# EAGLE design 328p_ver3_without_gnd_plane (EAGLE 7.1.0)
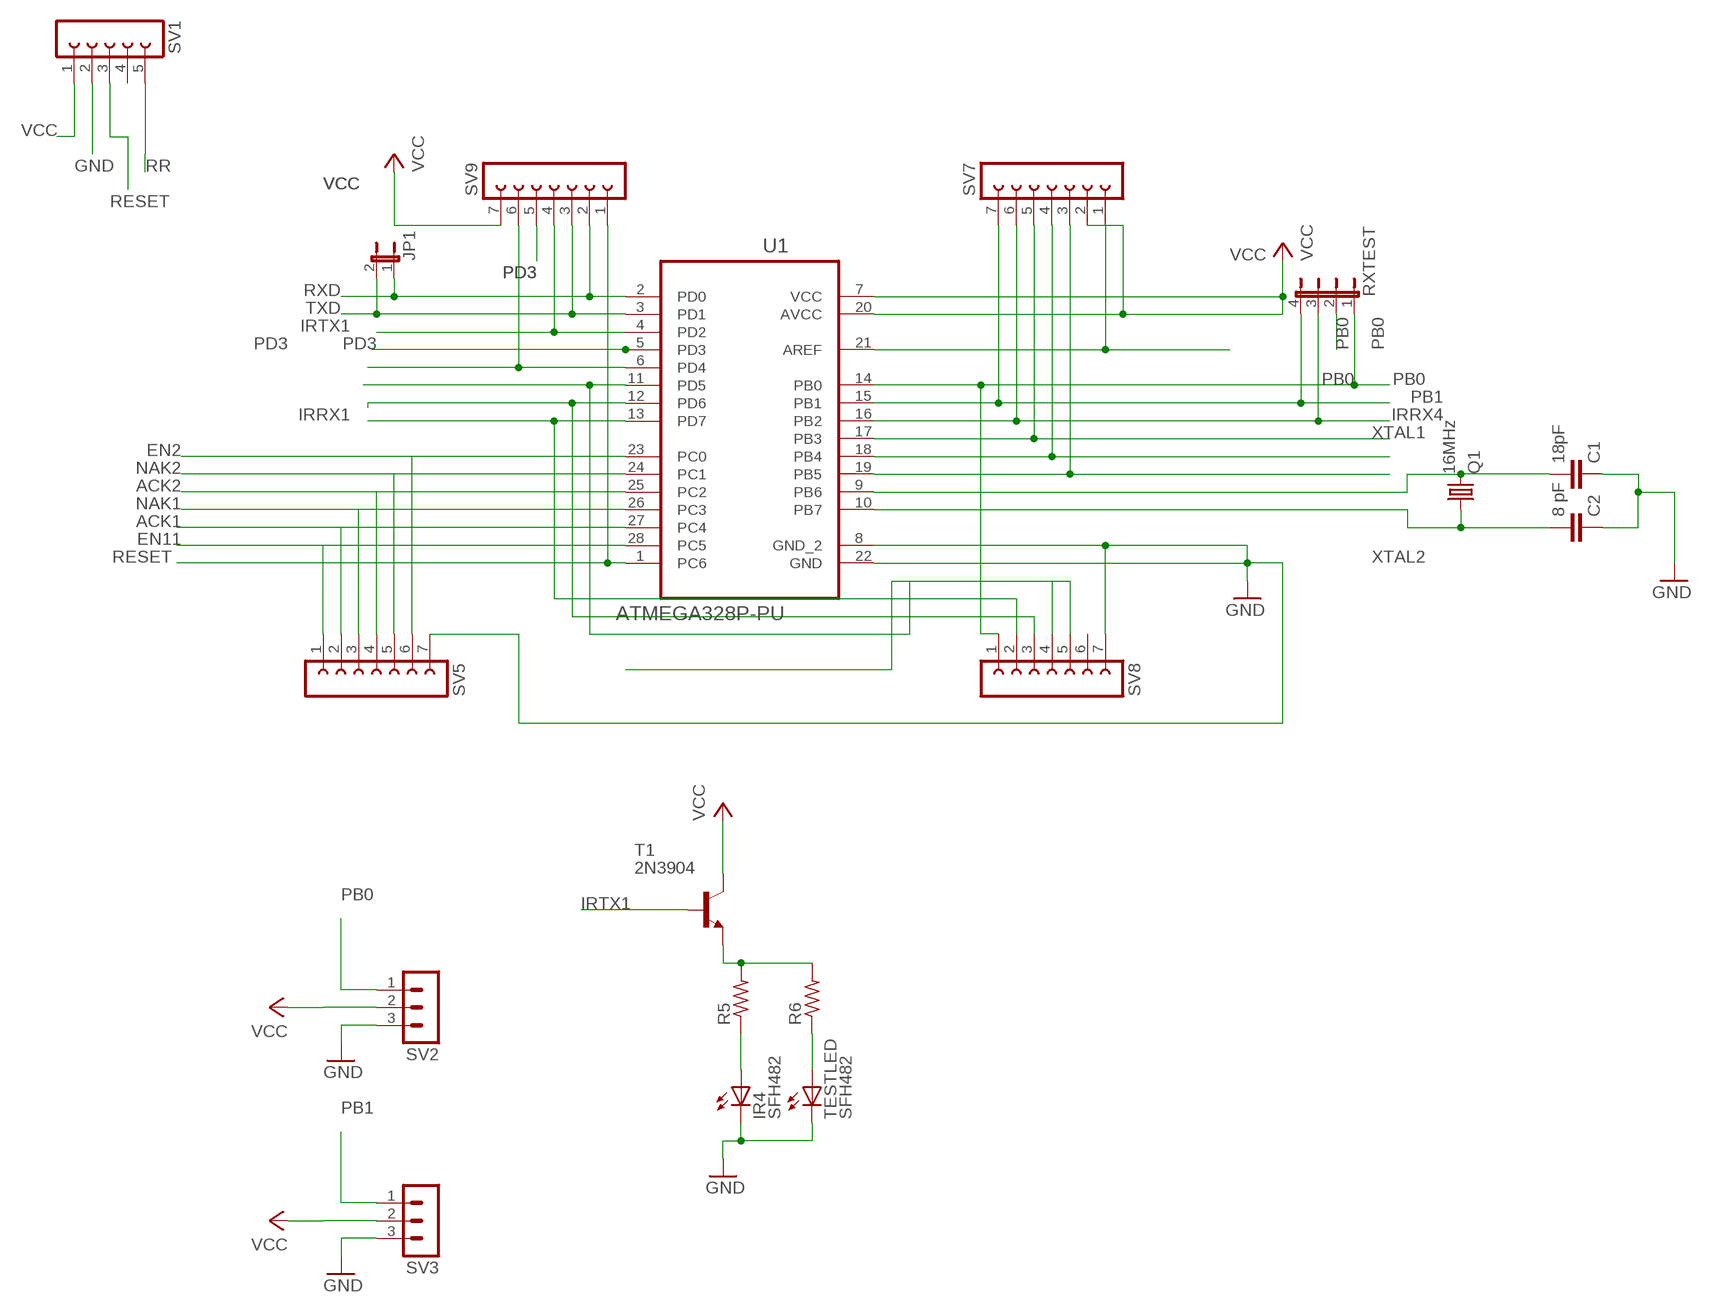
[diagram p0: schematic, sheet 1]

## Parts
C1  18pF  C2,5-3  [C2.5-3]
C2  8 pF  C2,5-3  [C2.5-3]
IR4  SFH482  [SFH482]
JP1  JP1E  [JP1]
Q1  16MHz  CRYSTALHC49S  [HC49/S]
R5  R-US_0204/7  [0204/7]
R6  R-US_0204/7  [0204/7]
RXTEST  JP4E  [JP4]
SV1  FE05-1  [FE05-1]
SV2  MA03-1  [MA03-1]
SV3  MA03-1  [MA03-1]
SV5  FE07-1  [FE07]
SV7  FE07-1  [FE07]
SV8  FE07-1  [FE07]
SV9  FE07-1  [FE07]
T1  2N3904  [TO92]
TESTLED  SFH482  [SFH482]
U1  ATMEGA328P-PU  [DIP254P762X457-28]

## Nets
ACK1: SV5.2 U1.27(PC4)
ACK2: SV5.4 U1.25(PC2)
EN1: SV8.5
EN2: SV5.6 U1.23(PC0)
EN11: SV5.1 U1.28(PC5)
GND: C1.1 C2.1 IR4.K(C) SV1.2 SV2.3 SV3.3 SV5.7 SV8.7 TESTLED.K(C) U1.8(GND_2) U1.22(GND)
IRRX1: RXTEST.2 SV8.2 U1.13(PD7)
IRRX4: RXTEST.3 SV7.6 U1.16(PB2)
IRTX1: SV9.4 T1.2(B) U1.4(PD2)
N$5: IR4.A R5.1
N$6: R5.2 R6.2 T1.3(E)
N$10: R6.1 TESTLED.A
N$15: SV7.5 U1.17(PB3)
N$16: SV7.4 U1.18(PB4)
N$17: SV7.3 U1.19(PB5)
N$18: SV7.1 U1.21(AREF)
N$20: SV9.6 U1.6(PD4)
N$21: SV2.2 SV3.2 T1.1(C) ; supply symbol labelled VCC
N$25: SV8.3 U1.12(PD6)
NAK1: SV5.3 U1.26(PC3)
NAK2: SV5.5 U1.24(PC1)
PB0: RXTEST.1 SV2.1 SV8.1 U1.14(PB0)
PB1: RXTEST.4 SV3.1 SV7.7 U1.15(PB1)
PD3: SV9.5 U1.5(PD3)
PD5: SV8.4 U1.11(PD5)
RESET: SV1.3 SV9.1 U1.1(PC6)
RR: SV1.5
RXD: JP1.1 SV9.2 U1.2(PD0)
TXD: JP1.2 SV9.3 U1.3(PD1)
VCC: SV1.1 SV7.2 SV9.7 U1.7(VCC) U1.20(AVCC)
XTAL1: C1.2 Q1.2 U1.9(PB6)
XTAL2: C2.2 Q1.1 U1.10(PB7)
Unconnected: SV1.4 SV8.6

## Library data of the parts
C1 C2 = capacitor-wima:C: CAPACITOR naming: grid - package width
IR4 TESTLED = led:SFH482: IR LED infrared emitting diode, Infineon
JP1 = jumper:JP1E: JUMPER
Q1 = crystal:CRYSTAL: CRYSTAL; OC_FARNELL: 1667008; OC_NEWARK: unknown
R5 R6 = resistor:R-US_: RESISTOR, American symbol
RXTEST = jumper:JP4E: JUMPER
SV1 = con-lsta:FE05-1: FEMALE HEADER; OC_FARNELL: unknown; OC_NEWARK: unknown
SV2 SV3 = con-lstb:MA03-1: PIN HEADER; OC_FARNELL: unknown; OC_NEWARK: unknown
SV5 SV7-SV9 = con-lsta:FE07-1: FEMALE HEADER; OC_FARNELL: unknown; OC_NEWARK: unknown
T1 = transistor:2N3904: NPN TRANSISTOR
U1 = Atmel_By_element14_Batch_1-00:ATMEGA328P-PU: 8-bit Microcontroller with In-System Programmable Flash; MPN: ATMEGA328P-PU; OC_FARNELL: 1715487; OC_NEWARK: 15R0268; PACKAGE: PDIP-28; SUPPLIER: Atmel

## Board
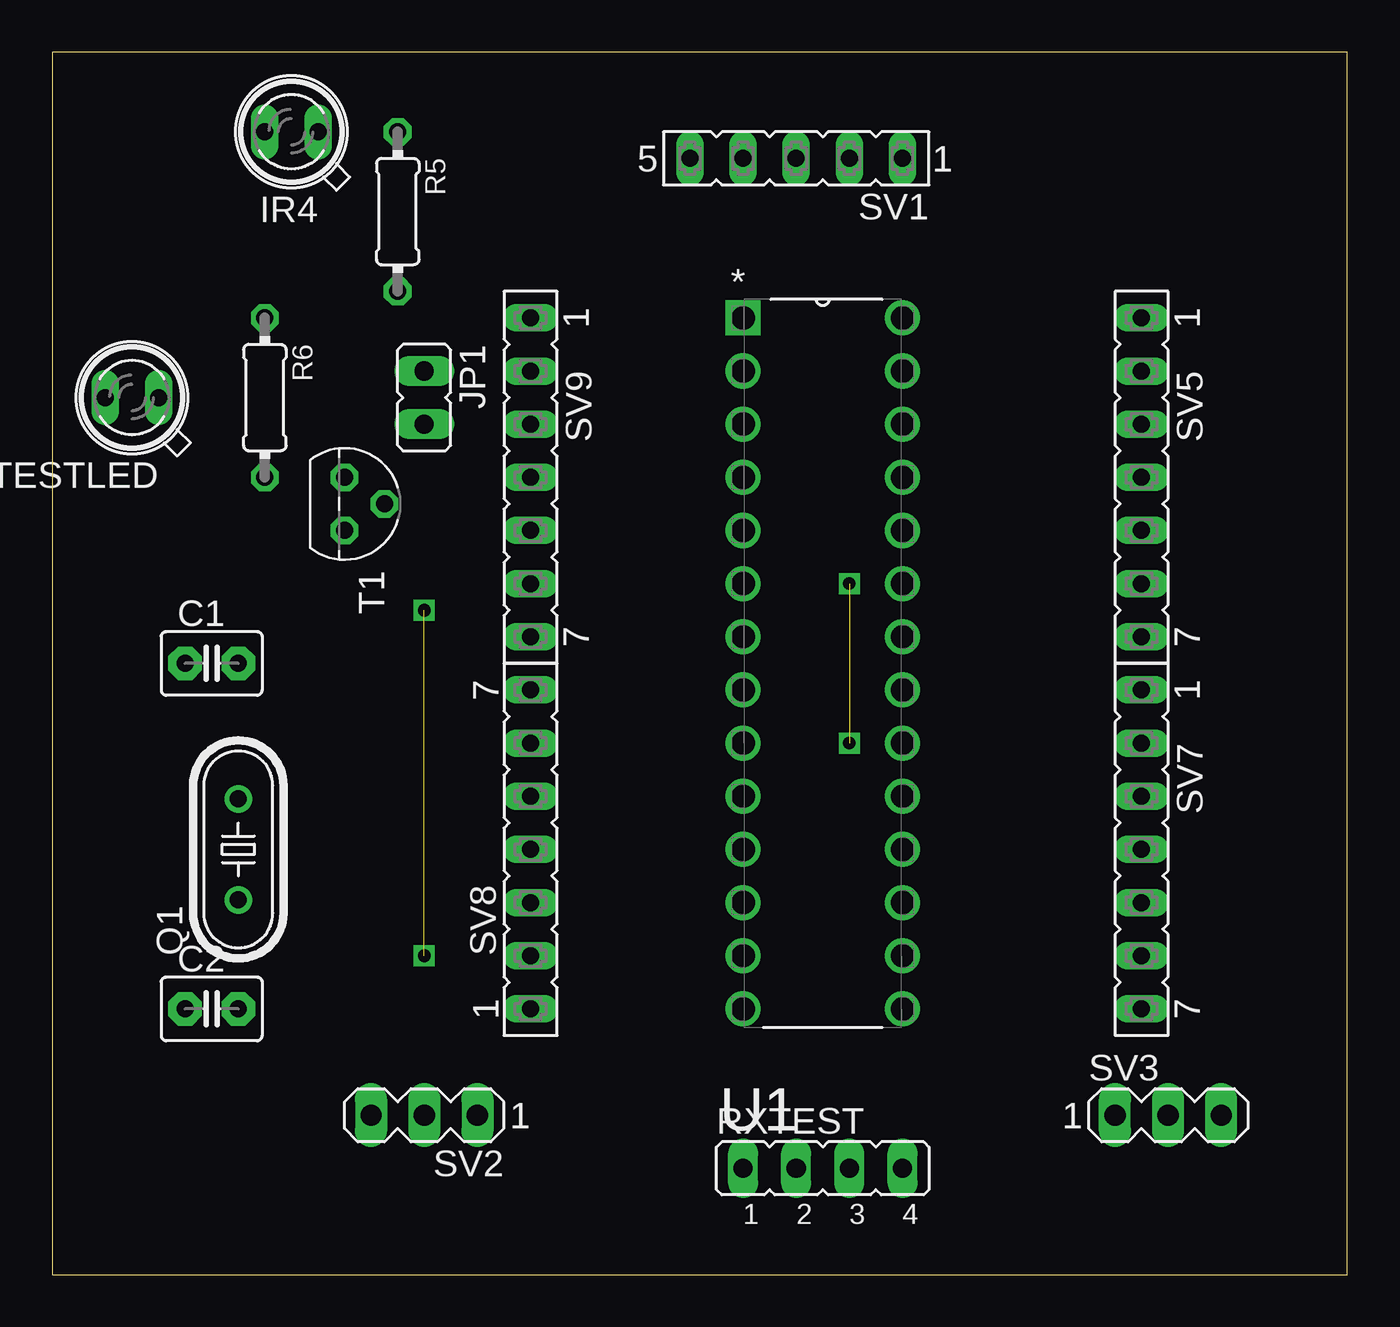
[diagram p1: board, top side]
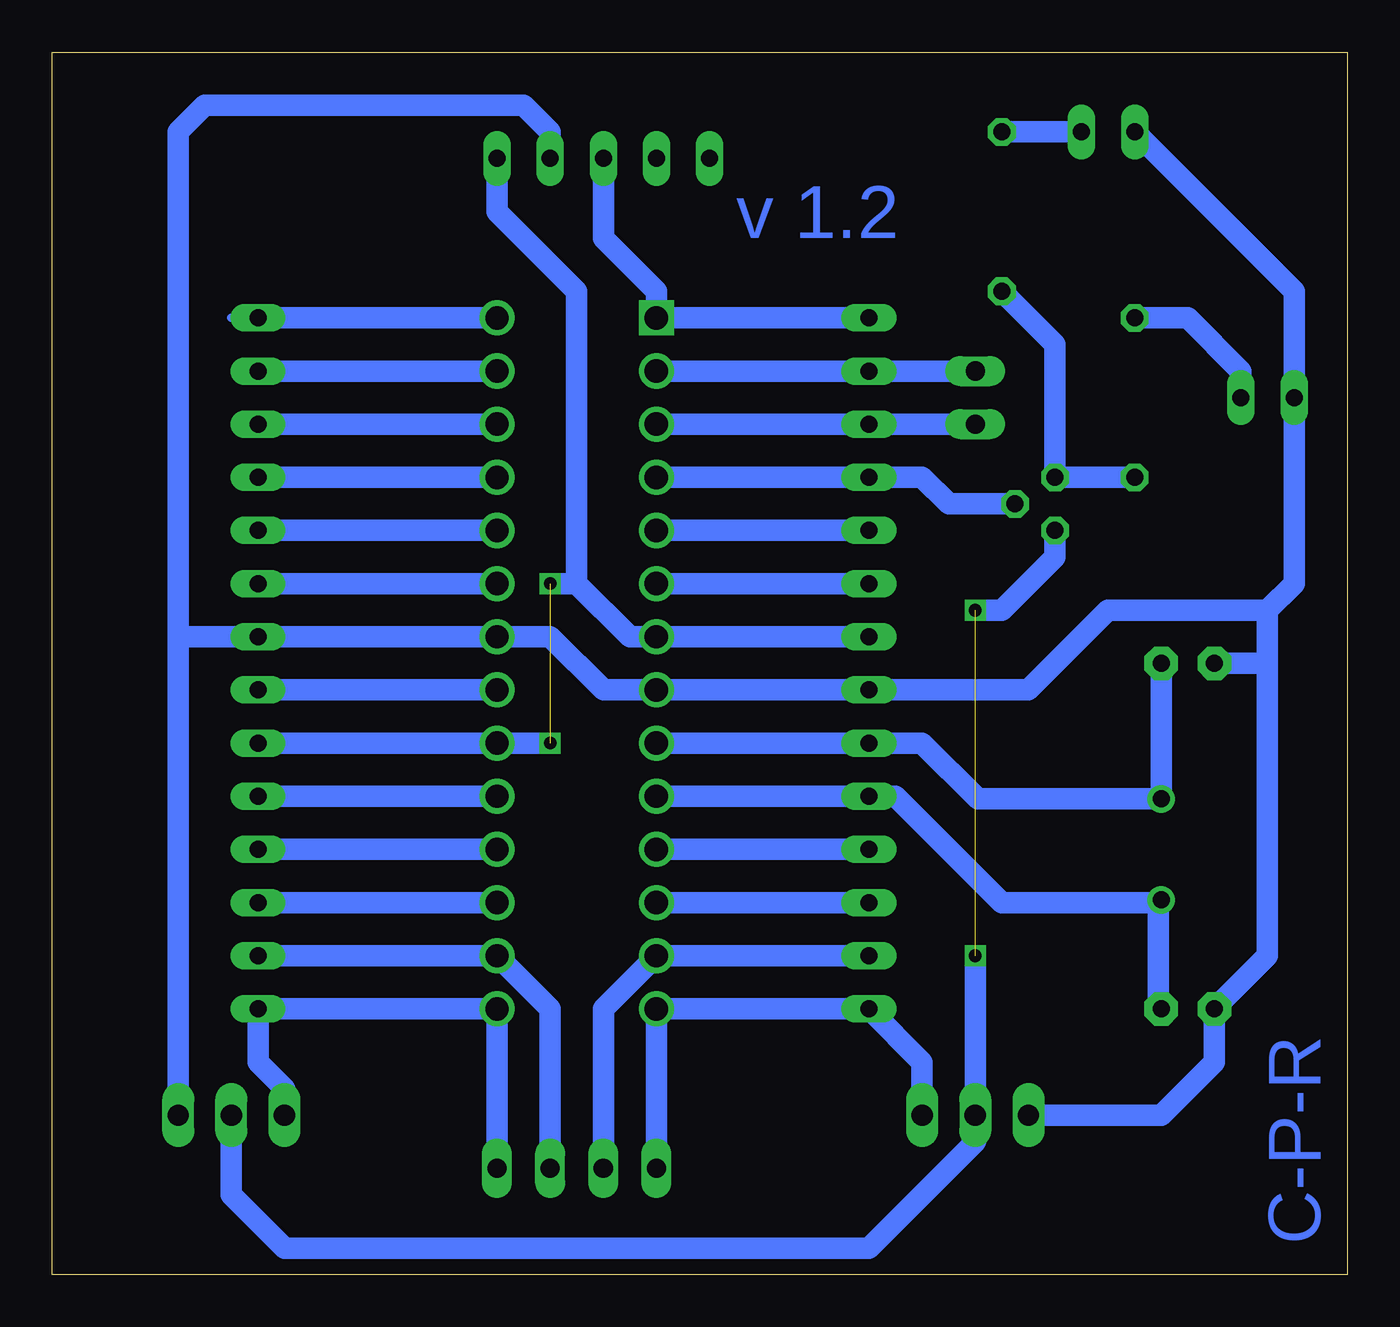
[diagram p2: board, bottom side, seen from below]

Size 61.9 x 58.41 mm. Coordinates in mm from the lower left corner, seen from the top.
Outline: 0,0 61.9,0 61.9,58.41 0,58.41 0,0
Copper layers (1*16): Top 0.035mm / dielectric 1.5mm / Bottom 0.035mm
Design rules "default": minimum track width 10mil, minimum drill 24mil, track to track 8mil, track to pad 8mil, pad to pad 8mil, via to via 8mil, smd to smd 8mil, copper to edge 40mil, drill to drill 8mil, minimum pad ring 10mil, minimum via ring 8mil, stop-mask expansion 4mil, vias tented up to drill 0mil, thermal gap 10mil

### Footprints (pad centres in the part's own frame; a part is rotated, then mirrored left to right if it is on the bottom)
C2.5-3 = drill 0.813 pad 1.6 octagon: 1 -1.27,0; 2 1.27,0
SFH482 = drill 0.813 long: A -1.27,0; K 1.27,0
JP1 = drill 0.914 long: 1 0,-1.27; 2 0,1.27
HC49/S = drill 0.813: 1 -2.413,0; 2 2.413,0
0204/7 = drill 0.813 octagon: 1 -3.81,0; 2 3.81,0
JP4 = drill 0.914 long: 1 -3.81,0; 2 -1.27,0; 3 1.27,0; 4 3.81,0
FE05-1 = drill 0.813 long: 1 -5.08,0; 2 -2.54,0; 3 0,0; 4 2.54,0; 5 5.08,0
MA03-1 = drill 1.016 long: 1 -2.54,0; 2 0,0; 3 2.54,0
FE07 = drill 0.813 long: 1 -7.62,0; 2 -5.08,0; 3 -2.54,0; 4 0,0; 5 2.54,0; 6 5.08,0; 7 7.62,0
TO92 = drill 0.813 octagon: 1 1.27,0; 2 0,1.905; 3 -1.27,0
DIP254P762X457-28 = drill 1.118 square: 1 -7.62,33.02 | drill 1.118: 2 -7.62,30.48; 3 -7.62,27.94; 4 -7.62,25.4; 5 -7.62,22.86; 6 -7.62,20.32; 7 -7.62,17.78; 8 -7.62,15.24; 9 -7.62,12.7; 10 -7.62,10.16; 11 -7.62,7.62; 12 -7.62,5.08; 13 -7.62,2.54; 14 -7.62,0; 15 0,0; 16 0,2.54; 17 0,5.08; 18 0,7.62; 19 0,10.16; 20 0,12.7; 21 0,15.24; 22 0,17.78; 23 0,20.32; 24 0,22.86; 25 0,25.4; 26 0,27.94; 27 0,30.48; 28 0,33.02

### Placement (x,y rotation side)
C1  7.62,29.21 0 top
C2  7.62,12.7 0 top
IR4  11.43,54.61 180 top
JP1  17.78,41.91 180 top
Q1  8.89,20.32 90 top
R5  16.51,50.8 270 top
R6  10.16,41.91 270 top
RXTEST  36.83,5.08 0 top
SV1  35.56,53.34 180 top
SV2  17.78,7.62 180 top
SV3  53.34,7.62 0 top
SV5  52.07,38.1 270 top
SV7  52.07,20.32 270 top
SV8  22.86,20.32 90 top
SV9  22.86,38.1 270 top
T1  13.97,36.83 270 top
TESTLED  3.81,41.91 180 top
U1  40.64,12.7 0 top

### Tracks (layer width: path | path; a pad name or v marks a point on that pad's centre or on a via)
ACK1
  Bottom 1.016: U1.27 SV5.2
ACK2
  Bottom 1.016: U1.25 SV5.4
EN2
  Bottom 1.016: U1.23 SV5.6
EN11
  Bottom 0.406: 53.34,45.72 SV5.1
  Bottom 1.016: U1.28 SV5.1
GND
  Bottom 1.016: SV3.3 55.88,30.48 | 55.88,30.48 55.88,54.61 54.61,55.88 39.37,55.88 38.1,54.61 SV1.2 | 55.88,30.48 SV5.7 U1.22 38.1,30.48 35.56,27.94 U1.8 SV8.7 15.24,27.94 11.43,31.75 3.81,31.75 | SV2.3 8.89,7.62 6.35,10.16 C2.1 3.81,15.24 3.81,29.21 | 3.81,31.75 3.81,29.21 | 3.81,29.21 C1.1 | 3.81,31.75 2.54,33.02 TESTLED.K 2.54,46.99 IR4.K
IRRX1
  Bottom 0.406: 24.13,15.24 SV8.2
  Bottom 1.016: SV8.2 U1.13 35.56,12.7 RXTEST.2
IRRX4
  Bottom 1.016: SV7.6 U1.16 38.1,12.7 RXTEST.3
IRTX1
  Bottom 1.016: U1.4 SV9.4 20.32,38.1 19.05,36.83 T1.2
N$1  (via drill 0.6)
  other vias: 38.1,25.4
N$2  (via drill 0.6)
  other vias: 17.78,31.75
N$5
  Bottom 1.016: IR4.A R5.1
N$6
  Bottom 1.016: R6.2 T1.3 13.97,44.45 R5.2
N$10
  Bottom 1.016: R6.1 7.62,45.72 5.08,43.18 TESTLED.A
N$15
  Bottom 1.016: U1.17 SV7.5
N$16
  Bottom 1.016: U1.18 SV7.4
N$17
  Bottom 1.016: U1.19 SV7.3
N$18
  Bottom 1.016: U1.21 SV7.1
N$20
  Bottom 1.016: U1.6 SV9.6
N$21  (via drill 0.6)  (1 unrouted)
  Bottom 1.016: v17.78,15.24 SV2.2 17.78,6.35 22.86,1.27 50.8,1.27 53.34,3.81 SV3.2 | T1.1 13.97,34.29 16.51,31.75 17.78,31.75
N$25
  Bottom 1.016: U1.12 SV8.3
NAK1
  Bottom 1.016: U1.26 SV5.3
NAK2
  Bottom 1.016: U1.24 SV5.5
PB0
  Bottom 0.406: 20.32,8.89 SV2.1
  Bottom 1.016: SV2.1 20.32,10.16 SV8.1 U1.14 RXTEST.1
PB1
  Bottom 1.016: SV3.1 50.8,8.89 52.07,10.16 SV7.7 U1.15 RXTEST.4
PD3
  Bottom 1.016: U1.5 SV9.5
PD5
  Bottom 1.016: U1.11 SV8.4
RESET
  Bottom 1.016: SV9.1 U1.1 33.02,46.99 35.56,49.53 SV1.3
RXD
  Bottom 1.016: U1.2 SV9.2 JP1.1
TXD
  Bottom 1.016: U1.3 SV9.3 JP1.2
VCC  (via drill 0.6)  (1 unrouted)
  Bottom 1.016: SV7.2 U1.20 38.1,25.4 | SV9.7 U1.7 34.29,30.48 36.83,33.02 | SV1.1 40.64,50.8 36.83,46.99 36.83,33.02 | 36.83,33.02 v38.1,33.02
XTAL1
  Bottom 1.016: U1.9 20.32,25.4 17.65,22.73 Q1.2 C1.2
XTAL2
  Bottom 0.406: 9.02,17.78 Q1.1
  Bottom 1.016: U1.10 21.59,22.86 16.51,17.78 9.02,17.78 9.02,12.83 C2.2

### Text on the board
Bottom: v 1.2 | C-P-R